# Altium project PcbNichoir.PrjPcb
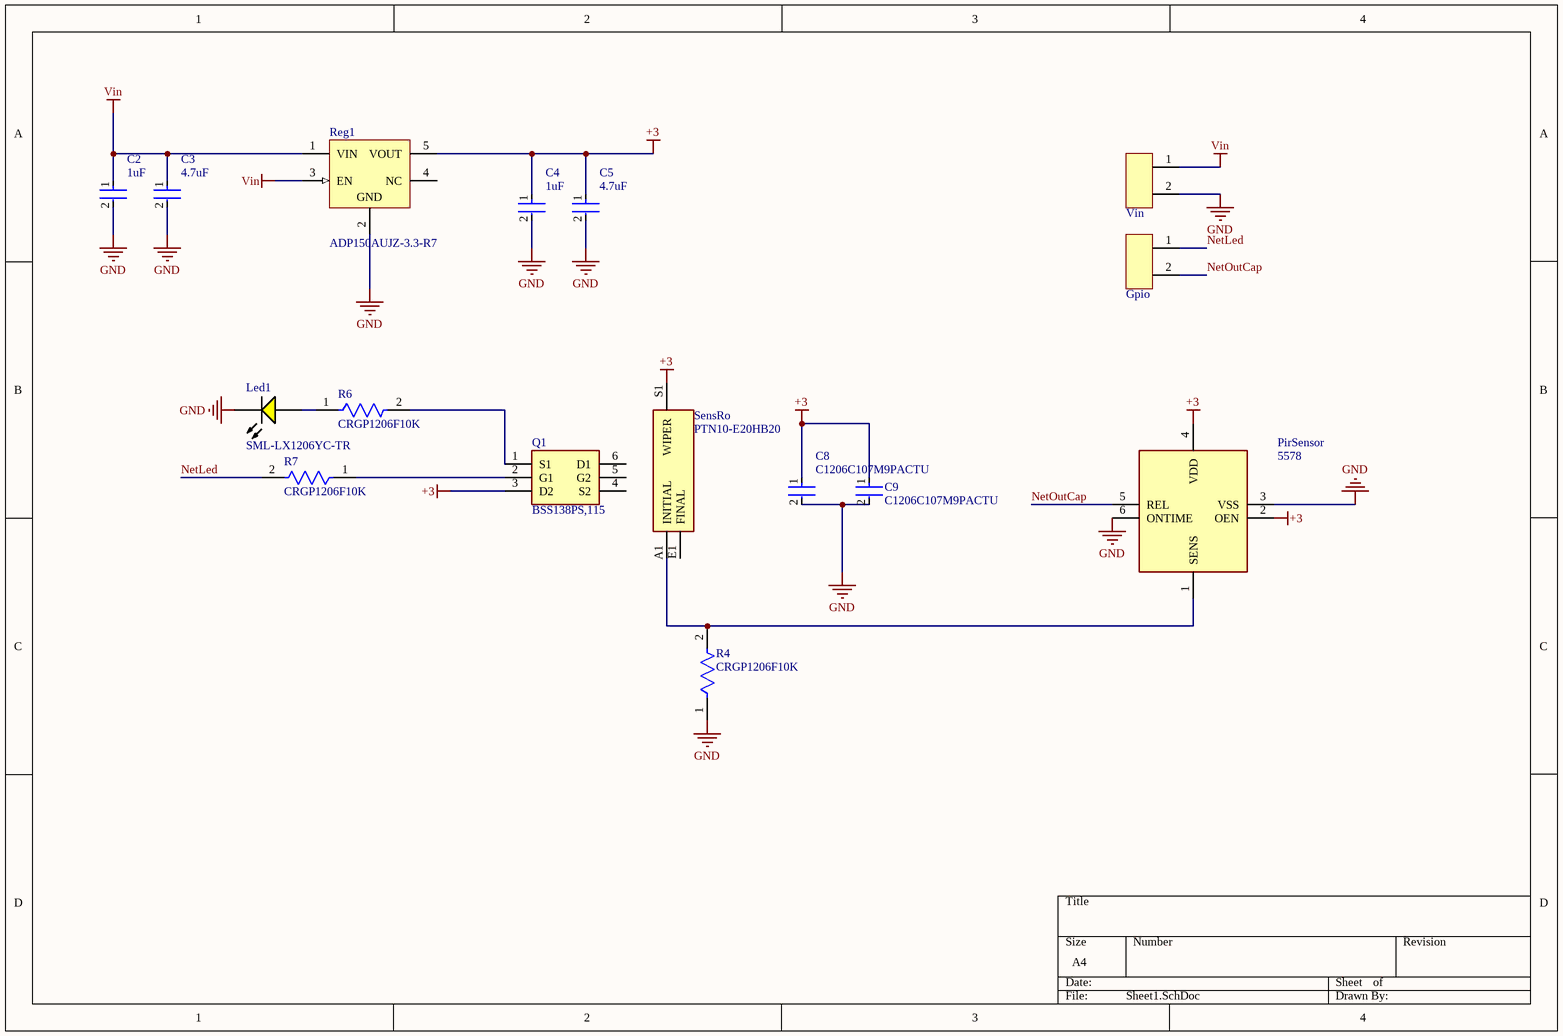
[diagram p0: Sheet1.SchDoc]
1 sheet, 16 parts. Net scope: global (net labels, ports and power ports of the same name join across sheets).
Board file: PCB2.PcbDoc

## Sheet Sheet1.SchDoc
size A4; SheetNumber: 1; SheetTotal: 1

### Parts
C2  1uF  [FP-C1206C-EH-MFG]
C3  4.7uF  [FP-C1206C-EH-MFG]
C4  1uF  [FP-C1206C-EH-MFG]
C5  4.7uF  [FP-C1206C-EH-MFG]
C8  C1206C107M9PACTU  [FP-C1206C-EH-MFG]
C9  C1206C107M9PACTU  [FP-C1206C-EH-MFG]
Gpio  (no value)  [TS-75x70]
Led1  SML-LX1206YC-TR  [LUMX-SML-LX1206YC-TR_V]
PirSensor  5578  [5578]
Q1  BSS138PS,115  [SOT65P210X110-6N]
R4  CRGP1206F10K  [FP-CRGP1206-IPC_C]
R6  CRGP1206F10K  [FP-CRGP1206-IPC_C]
R7  CRGP1206F10K  [FP-CRGP1206-IPC_C]
Reg1  ADP150AUJZ-3.3-R7  [ADI-UJ-5_M]
SensRo  PTN10-E20HB20  [PTN10E20HB20]
Vin  (no value)  [TS-75x70]

### Nets
+3: C4.1 C5.1 C8.1 C9.1 PirSensor.2(OEN) PirSensor.4(VDD) Q1.3(D2) Reg1.5(VOUT) SensRo.S1(WIPER)
GND: C2.2 C3.2 C4.2 C5.2 C8.2 C9.2 Led1.2(K) PirSensor.3(VSS) PirSensor.6(ONTIME) R4.1 Reg1.2(GND) Vin.2
Vin: C2.1 C3.1 Reg1.1(VIN) Reg1.3(EN) Vin.1
NetLed: Gpio.1 R7.2
NetOutCap: Gpio.2 PirSensor.5(REL)
NetLed1_1: Led1.1(A) R6.1
NetPirSensor_1: PirSensor.1(SENS) R4.2 SensRo.A1(INITIAL)
NetQ1_1: Q1.1(S1) R6.2
NetQ1_2: Q1.2(G1) R7.1

Not connected (* = marked no-connect by the designer): Q1 4(S2) 5(G2) 6(D1); Reg1 4(NC); SensRo E1(FINAL)

### Library data of the parts
C2-C5 C8 C9 = CMP-1037-05005-3: CAP CER 100UF 6.3V X5R 1206; Dielectric Material: Ceramic; Tolerance: 2%; Dissipation Factor: 5%; Min Operating Temperature: -55°C; Case Code (Imperial): 1206; Case Code (Metric): 3216; Depth: 1.6mm; Dielectric: X5R; Max Operating Temperature: 85°C; Packaging: Tape and Reel; Construction: Flat; Series: C; Case/Package: 1206; Radiation Hardening: No; Voltage Rating (DC): 6.3V; Termination: SMD/SMT; Voltage Rating: 6.3V; Capacitance: 100uF; Number of Pins: 2; RoHS Compliant: Yes; Height: 1.6mm; Lead Free: Lead Free; Voltage: 6.3V; REACH SVHC: No SVHC; Length: 3.2mm; Mount: Surface Mount; Package Quantity: 1; Thickness: 0.071inch; Width: 0.063inch
Gpio Vin = Connector-2: Fixed Terminal Blocks PT 1.5/2-3.5H 2POS HRZ 3.5mm SCREW; Manufacturer: Phoenix Contact; Manufacturer Part Number: 1984617; Supplier: Mouser; Supplier Part Number: 651-1984617; Supplier Unit Price: 0.55; MOQ: 1
Led1 = CMP-2000-07124-1: Yellow LED, Water Clear Len, 585 nm, 2.1 V, -40 to 85 degC, 2-Pin SMD, RoHS, Tape and Reel; Manufacturer: Lumex; Product Training Modules: LEDsBenefitsofCustomLEDandLCDTechnology; Millicandela Rating: 6mcd; Catalog Drawings: SML-LX1206SeriesTopSML-LX1206SeriesSideSML-LX1206SeriesBottomSML-LX1206SeriesFootprint; Wavelength - Peak: 585nm; Other Names: 67-1358-2LU60357TRSMLLX1206YCTR; Lens Style/Size: RectanglewithFlatTop; Current - Test: 20mA; Lens Color: Colorless; Viewing Angle: 160°; Voltage - Forward (Vf) (Typ): 2.1V; Online Catalog: SML-LX1206RectanglewithFlatTop1206PackageLEDs; Mounting Type: SurfaceMount; Package Description: 2-Pin Surface Mount Device, Body 3.2 x 1.5 mm; Datasheet Version: Rev. K, 08/2012; Features: -; Color: Yellow; RoHS Information: RoHSCertofCompliance; Package Reference: SML-LX1206YC-TR; Supplier Device Package: 1206; Standard Package: 3,000; Series: -; Wavelength - Dominant: -; Package / Case: 1206(3216Metric); Mounting Technology: SurfaceMount; Height (Max): 1.10mm; Lens Transparency: Clear; Datasheet URL: http://www.lumex.com/content/files/ProductAttachment/SML-LX1206YC-TR.pdf; Family: LEDIndication-Discrete; Manufacturer URL: http://www.lumexinstruments.com/; Packaging: Tape&Reel(TR); Category: Optoelectronics; Size / Dimension: 3.20mmLx1.60mmW
PirSensor = 5578: Integrated Circuit; Manufacturer_Name: Adafruit; Datasheet Link: https://cdn-shop.adafruit.com/product-files/5578/C17724.pdf; Height: 4.4mm; Manufacturer_Part_Number: 5578; Mouser Part Number: 485-5578; Mouser Price/Stock: https://www.mouser.co.uk/ProductDetail/Adafruit/5578?qs=T%252BzbugeAwji3%252BSdFXYinnQ%3D%3D
Q1 = BSS138PS,115: MOSFET (N-Channel); Manufacturer_Name: Nexperia; Datasheet Link: https://assets.nexperia.com/documents/data-sheet/BSS138PS.pdf; Height: 1.1mm; Manufacturer_Part_Number: BSS138PS,115; Mouser Part Number: 771-BSS138PS115; Mouser Price/Stock: https://www.mouser.co.uk/ProductDetail/Nexperia/BSS138PS115?qs=A1cBxND5mHLezFUI6z0jIg%3D%3D; Arrow Part Number: BSS138PS,115; Arrow Price/Stock: https://www.arrow.com/en/products/bss138ps115/nexperia?utm_currency=USD&region=nac
R4 R6 R7 = CMP-03211-004788-1: CRGP 1206 10K 1%; Manufacturer: TE; Temperature Coefficient: ±100ppm/°C; Resistance: 10KΩ; Value: 10KΩ; Tolerance: 0.01; Power Rating: 0.5W; Voltage Rating: 200V; Package: CRGP1206; Ambient Temperature Range High: +70°C; Device Class L2: Resistors; Lead Free: Yes; Automotive: No; Series: CRGP; Temperature Range High: +155°C; Ipc Land Pattern Name: RESC310155X55; Device Class L1: Passive Components; Octopart: https://octopart.com/crgp1206f10k-te+connectivity-91018843; Temperature: -55°C to +155°C; Category: Res; Height: 0.65mm; Temperature Range Low: -55°C; RoHS: TRUE; Manufacturer Part Number: CRGP1206F10K; Digikey Description: CRGP 1206 10K 1%; Device Class L3: Chip SMD Resistors; Composition: Thick Film; ComponentLink2URL: https://www.mouser.com/datasheet/2/418/NG_DS_9-1773463-9_A-1358566.pdf; ComponentLink2Description: Datasheet
Reg1 = CMP-0786-00394-1: Ultralow Noise, 150 mA CMOS Linear Regulator, 2.2 to 5.5 V Vin, 3.3 V Vout, Industrial, 5-pin SOT23 (UJ-5), Reel; Manufacturer: Analog Devices; Supply Current IGND @ Small Load: 10uA; Vin (min) (V): 2.2; Iout max: 150mA; Preset Vout Values (V): 3.3; Vin (max) (V): 5.5; ComponentLink2Description: Datasheet; PackageReference: UJ-5; DatasheetVersion: Rev. A; PackageDescription: 5-Pin Thin Small Outline Transistor Package, Body 2.9 x 1.6 mm, Pitch 0.95 mm; ComponentLink4URL: Product URL:http://www.analog.com/en/ADP150/productSearch.html; Packing: Reel; ComponentLink1URL: http://www.analog.com/en/index.html; PartNumber: ADP150AUJZ-3.3-R7; PackageVersion: 100708-A, 10/2008; ComponentLink3Description: Package Specification; ComponentLink3URL: http:/www.analog.com/static/imported-files/packages/PKG_PDF/TSOT(UJ)/UJ_5.pdf; ComponentLink4Description: URL Link1; ComponentLink2URL: http://www.analog.com/static/imported-files/data_sheets/ADP150.pdf; Code_JEDEC: MO-193-AB; Mounting Technology: Surface Mount; ComponentLink1Description: Manufacturer URL
SensRo = PTN10-E20HB20: Variable Resistor; Manufacturer_Name: Same Sky; Datasheet Link: https://www.sameskydevices.com/product/resource/supplyframepdf/ptn10.pdf; Height: 6.2mm; Manufacturer_Part_Number: PTN10-E20HB20; Mouser Part Number: 179-PTN10-E20HB20; Mouser Price/Stock: https://www.mouser.co.uk/ProductDetail/CUI-Devices/PTN10-E20HB20?qs=vvQtp7zwQdNJZy18bg52oA%3D%3D